# EAGLE design trot_activateur_ES200 (EAGLE 9.3.0)
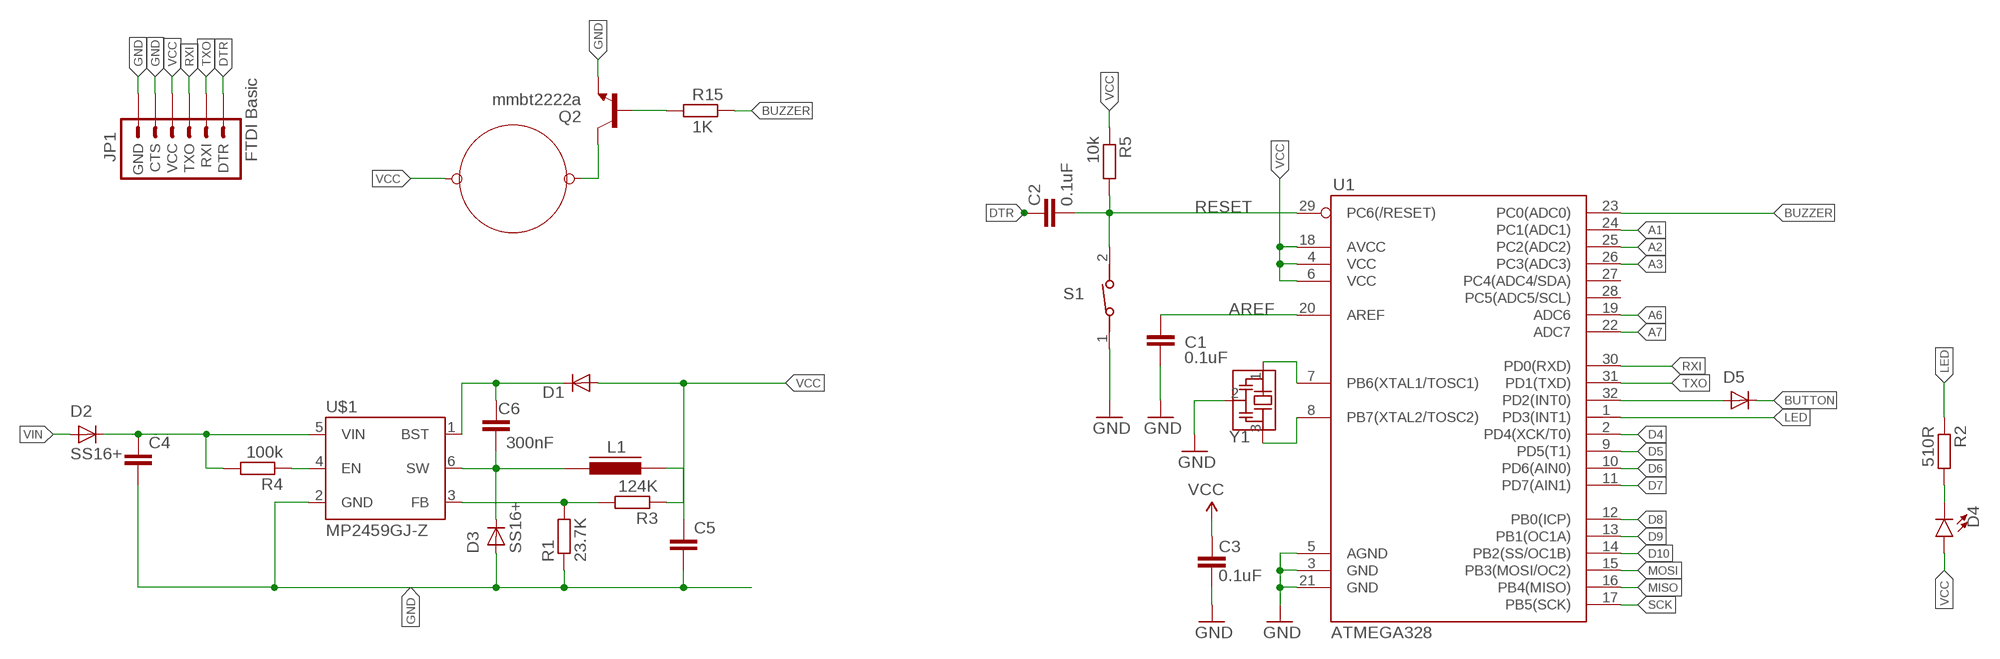
[diagram p0: schematic, sheet 1]

## Parts
C1  0.1uF  C-EUC0603  [C0603]
C2  0.1uF  C-EUC0603  [C0603]
C3  0.1uF  C-EUC0603  [C0603]
C4  4.7uF; X7R; 50V  C-EUC1210  [C1210]
C5  22uF;X7R;10V  C-EUC1210  [C1210]
C6  300nF  C-EUC0603  [C0603]
D1  1N4148W RH  DIODE-SOD123  [SOD123]
D2  SS16+  GF1  [SMA-DO214AC]
D3  SS16+  GF1  [SMA-DO214AC]
D4  LED0603  [LED-0603]
D5  SS16+  GF1  [SMA-DO214AC]
JP1  FTDI Basic  ARDUINO_SERIAL_PROGRAMPTH  [1X06]
L1  VLS5045EX-151M  VLS5045EX  [VLS5045EX]
Q2  mmbt2222a  SPARKFUN_TRANSISTOR_NPNSOT23-3  [SPARKFUN_SOT23-3]
R1  23.7K  R-EU_R0603  [R0603]
R2  510R  R-EU_R0603  [R0603]
R3  124K  R-EU_R0603  [R0603]
R4  100k  R-EU_R0603  [R0603]
R5  10k  R-EU_R0603  [R0603]
R15  1K  R-EU_R0603  [R0603]
S1  434113025826  [434113025826]
U1  ATMEGA328  SPARKFUN_ATMEGA168  [SPARKFUN_TQFP32-08]
U$1  MP2459GJ-Z  [SOT23-6]
U$6  BUZZER-KPX-G1203UB  [BUZZER-KPX-G1203UB]
Y1  CSTNE16M0V530000R0  [OSC_CSTNE16M0V530000R0]

## Nets
A1: U1.24(PC1(ADC1))
A2: U1.25(PC2(ADC2))
A3: U1.26(PC3(ADC3))
A6: U1.19(ADC6)
A7: U1.22(ADC7)
AREF: C1.2 U1.20(AREF)
BUTTON: D5.K(C)
BUZZER: R15.2 U1.23(PC0(ADC0))
D4: U1.2(PD4(XCK/T0))
D5: U1.9(PD5(T1))
D6: U1.10(PD6(AIN0))
D7: U1.11(PD7(AIN1))
D8: U1.12(PB0(ICP))
D9: U1.13(PB1(OC1A))
D10: U1.14(PB2(SS/OC1B))
DTR: C2.2 JP1.1(DTR)
GND [Default]: C1.1 C3.1 C4.2 C5.2 D3.A JP1.5(CTS) JP1.6(GND) Q2.2(E) R1.1 S1.1 U1.3(GND) U1.5(AGND) U1.21(GND) U$1.2(GND) Y1.2(GND)
LED: R2.1 U1.1(PD3(INT1))
MISO: U1.16(PB4(MISO))
MOSI: U1.15(PB3(MOSI/OC2))
N$1: U1.8(PB7(XTAL2/TOSC2)) Y1.3(OUT)
N$2: U1.7(PB6(XTAL1/TOSC1)) Y1.1(IN)
N$3: R4.1 U$1.4(EN)
N$4: C4.1 D2.K(C) R4.2 U$1.5(VIN)
N$5: R1.2 R3.2 U$1.3(FB)
N$6: C6.2 D3.K(C) L1.P$1 U$1.6(SW)
N$7: C6.1 D1.C U$1.1(BST)
N$8: D4.C R2.2
N$10: D5.A U1.32(PD2(INT0))
N$11: Q2.1(B) R15.1
N$12: Q2.3(C) U$6.P$2
RESET: C2.1 R5.2 S1.2 U1.29(PC6(/RESET))
RXI: JP1.3(TXO) U1.30(PD0(RXD))
SCK: U1.17(PB5(SCK))
TXO: JP1.2(RXI) U1.31(PD1(TXD))
VCC: C3.2 C5.1 D1.A D4.A JP1.4(VCC) L1.P$2 R3.1 R5.1 U1.4(VCC) U1.6(VCC) U1.18(AVCC) U$6.P$1
VIN: D2.A
Unconnected: U1.27(PC4(ADC4/SDA)) U1.28(PC5(ADC5/SCL))

## Library data of the parts
C1-C6 = rcl_custom:C-EU: CAPACITOR, European symbol; SPICEPREFIX: C
D1 = diode:DIODE-: DIODE
D2 D3 D5 = diode:GF1: DIODE
D4 = LED:LED: LED (Generic) Standard schematic elements and footprints for 5mm, 3mm, 1206, and 0603 sized LEDs. Generic LEDs with no color specified.
JP1 = SparkFun:ARDUINO_SERIAL_PROGRAM
L1 = inductors_custom:VLS5045EX
Q2 = Adafruit HUZZAH32 ESP32 Feather:SPARKFUN_TRANSISTOR_NPN: Transistor NPN BJT configuration in SOT23 package. MMBT2222 is the common NPN we use. Double check BCE configuration again layout.
R1 R3 = rcl:R-EU_: RESISTOR, European symbol; SPICEPREFIX: R
R2 R4 R5 R15 = rcl_custom:R-EU_: RESISTOR, European symbol; SPICEPREFIX: R
S1 = switch:434113025826: 6.0x3.8 mm SMD J-Bend WS-TASV <http://katalog.we-online.de/media/images/v2/Family_WS-TASV_J-Bend_SMD_6.0x3.jpg> Details see: http://katalog.we-online.de/em/datasheet/4341x30258xx.pdf 2015 (C) Wurth Elektronik
U1 = Atmel_MCU:SPARKFUN_ATMEGA168
U$1 = v-reg-custom:MP2459GJ-Z
U$6 = Buzzer-KPX-G1203UB:BUZZER-KPX-G1203UB
Y1 = crystal_TCXO_RTC:CSTNE16M0V530000R0: 16MHz Ceramic Resonator Built in Capacitor 15pF ±0.15% 40 Ohms -40°C ~ 125°C Surface Mount Check prices <https://pricing.snapeda.com/parts/CSTNE16M0V530000R0/Murata%20Electronics/view-part?ref=eda>; AVAILABILITY: In Stock; DESCRIPTION: 16 MHz Ceramic Resonator Built in Capacitor 15 pF ±0.3% 40 Ohms -40°C ~ 85°C Surface Mount; MF: Murata Electronics; MP: CSTNE16M0V530000R0; PACKAGE: SMD-3 Murata; PRICE: None; PURCHASE-URL: https://pricing.snapeda.com/search/part/CSTNE16M0V530000R0/?ref=eda

## Net classes
0 Pwr: width 0.305 mm, drill 0.3 mm
1 Default: width 0.305 mm, drill 0.3 mm

## Board
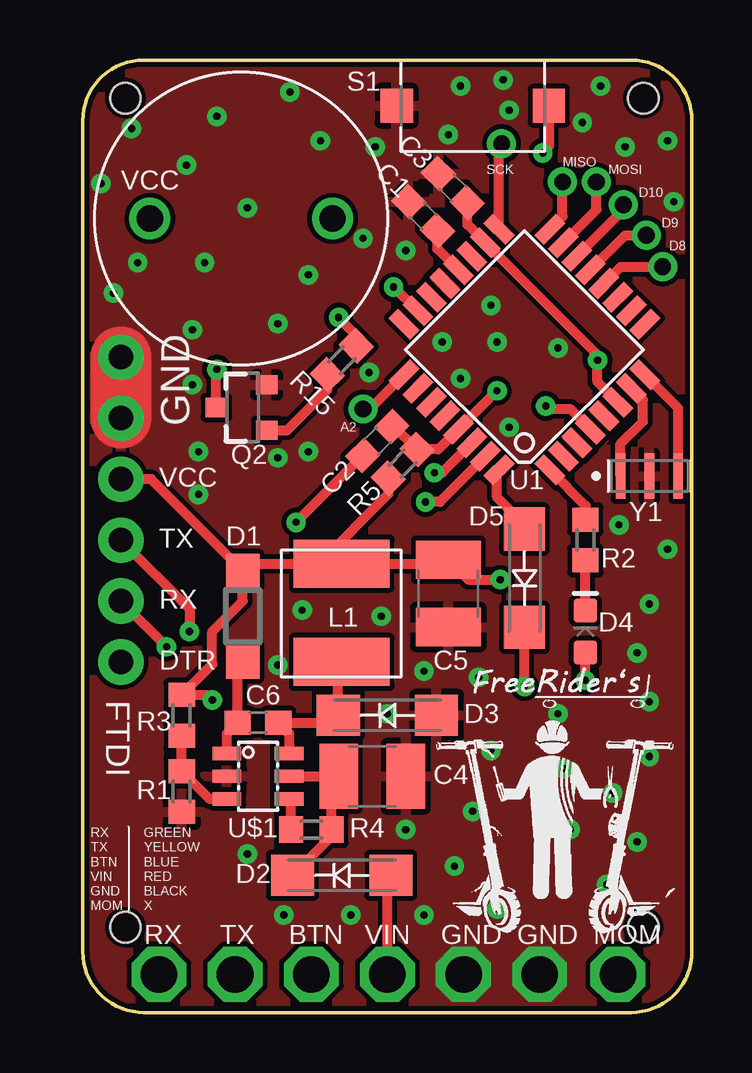
[diagram p1: board, top side]
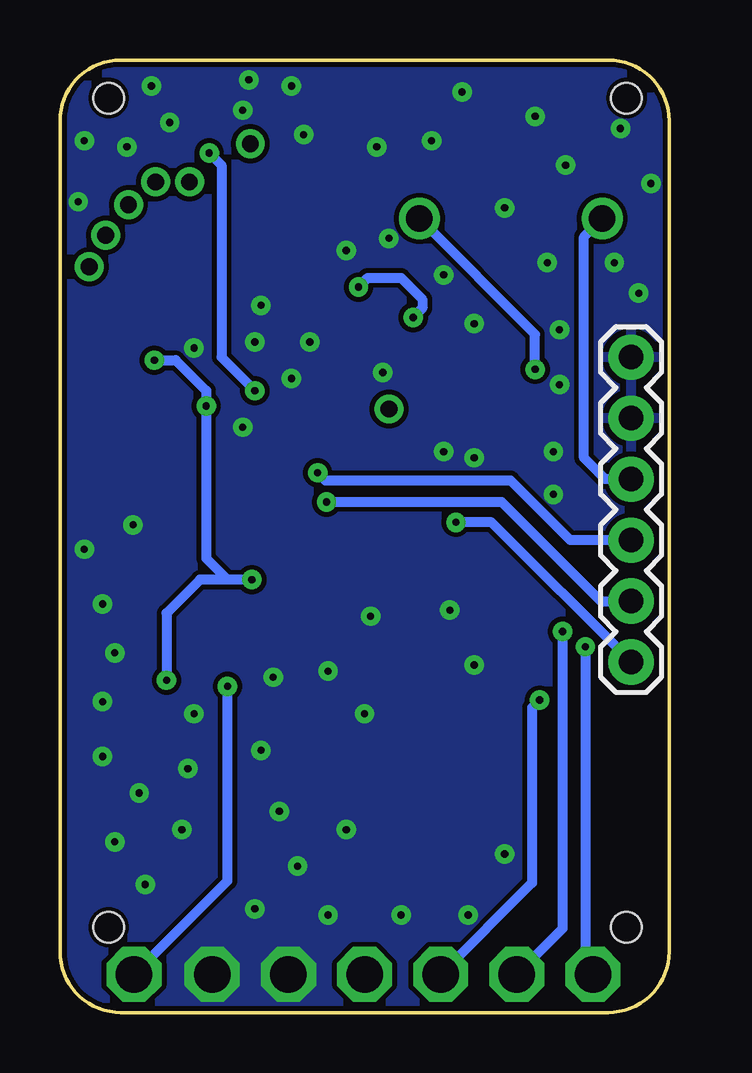
[diagram p2: board, bottom side, seen from below]

Size 25.4 x 39.69 mm. Coordinates in mm from the lower left corner, seen from the top.
Outline: 0,2.54 arc90 2.54,0 22.86,0 arc90 25.4,2.54 25.4,37.15 arc90 22.86,39.69 2.54,39.69 arc90 0,37.15 0,2.54
Copper layers (1*16): Top 0.035mm / dielectric 1.5mm / Bottom 0.035mm
Design rules "SparkFun-2-layer *": minimum track width 7mil, minimum drill 0.3mm, track to track 8mil, track to pad 8mil, pad to pad 8mil, via to via 8mil, smd to smd 8mil, copper to edge 8mil, drill to drill 8mil, minimum pad ring 12mil, minimum via ring 10mil, stop-mask expansion 4mil, vias tented up to drill 20mil, thermal gap 10mil
Holes 1.27 mm at 1.78,3.56 23.37,3.56 23.37,38.1 1.78,38.1

### Footprints (pad centres in the part's own frame; a part is rotated, then mirrored left to right if it is on the bottom)
C0603 = smd 1.1 x 1: 1 -0.85,0; 2 0.85,0
C1210 = smd 1.6 x 2.7: 1 -1.4,0; 2 1.4,0
SOD123 = smd 1.4 x 1.4: A 1.9,0; C -1.9,0
SMA-DO214AC = smd 1.8 x 1.7: A -2.05,0; K 2.05,0
LED-0603 = smd 1 x 1: A -0.877,0; C 0.877,0
1X06 = drill 1.016 pad 1.88: 1 0,0; 2 2.54,0; 3 5.08,0; 4 7.62,0; 5 10.16,0; 6 12.7,0
VLS5045EX = smd 2 x 4: P$1 0,0; P$2 4.1,0
SPARKFUN_SOT23-3 = smd 0.8 x 0.9: 1 -0.95,-1; 2 0.95,-1; 3 0,1.1
R0603 = smd 1 x 1.1: 1 -0.85,0; 2 0.85,0
434113025826 = smd 1.35 x 1.4: 1 -3.175,0; 2 3.175,0
SPARKFUN_TQFP32-08 = smd 1.27 x 0.559: 1 -4.293,2.8; 2 -4.293,2; 3 -4.293,1.2; 4 -4.293,0.4; 5 -4.293,-0.4; 6 -4.293,-1.2; 7 -4.293,-2; 8 -4.293,-2.8; 17 4.293,-2.8; 18 4.293,-2; 19 4.293,-1.2; 20 4.293,-0.4; 21 4.293,0.4; 22 4.293,1.2; 23 4.293,2; 24 4.293,2.8 | smd 0.559 x 1.27: 9 -2.8,-4.293; 10 -2,-4.293; 11 -1.2,-4.293; 12 -0.4,-4.293; 13 0.4,-4.293; 14 1.2,-4.293; 15 2,-4.293; 16 2.8,-4.293; 25 2.8,4.293; 26 2,4.293; 27 1.2,4.293; 28 0.4,4.293; 29 -0.4,4.293; 30 -1.2,4.293; 31 -2,4.293; 32 -2.8,4.293
SOT23-6 = smd 0.55 x 1.2: 1 -0.95,-1.3; 2 0,-1.3; 3 0.95,-1.3; 4 0.95,1.3; 5 0,1.3; 6 -0.95,1.3
BUZZER-KPX-G1203UB = drill 1.1: P$1 3.81,0; P$2 -3.81,0
OSC_CSTNE16M0V530000R0 = smd 0.4 x 1.9: 1 -1.2,0; 2 0,0; 3 1.2,0

### Placement (x,y rotation side)
C1  14.19,33.19 315 top
C2  12.28,23.81 225 top
C3  15.43,34.35 315 top
C4  12.07,9.84 0 top
C5  15.24,17.46 270 top
C6  7.3,12.07 0 top
D1  6.67,16.51 90 top
D2  10.79,5.71 180 top
D3  12.7,12.38 180 top
D4  20.95,15.88 90 top
D5  18.41,18.1 270 top
JP1  1.59,14.61 90 bottom
L1  10.79,14.61 90 top
Q2  6.67,25.21 90 top
R1  4.13,9.21 90 top
R2  20.95,19.68 270 top
R3  4.13,12.38 270 top
R4  9.53,7.62 0 top
R5  13.34,22.86 45 top
R15  10.79,27.18 45 top
S1  16.26,37.78 0 top
U1  18.41,27.62 135 top
U$1  7.3,9.84 270 top
U$6  6.6,33.08 180 top
Y1  23.62,22.35 0 top

### Tracks (layer width: path | path; a pad name or v marks a point on that pad's centre or on a via)
A2  (via drill 0.7)
  Top 0.406: U1.25 11.98,25.15 v11.68,25.15
AREF
  Top 0.406: U1.20 14.79,31.82 C1.2
BUTTON  (via drill 0.3, 1.52)
  Top 0.406: v18.42,13.59 D5.K
  Bottom 0.406: v22.31,1.59 18.42,5.49 v18.42,13.59
BUZZER  (via drill 0.3, 0.3 pad 0.7)
  Top 0.406: U1.23 12.98,30.23 v12.95,30.23 | v10.67,28.96 11.4,28.23 R15.2
  Bottom 0.406: v12.95,30.23 12.57,30.61 11.18,30.61 10.29,29.72 10.29,29.34 v10.67,28.96
D8  (via drill 0.7)
  Top 0.406: U1.12 22.43,31.07 v24.18,31.07
D9  (via drill 0.7)
  Top 0.406: U1.13 22.61,32.39 v23.5,32.39
D10  (via drill 0.7)
  Top 0.406: U1.14 22.54,33.45 v22.54,33.66
DTR  (via drill 0.3)
  Top 0.406: v8.89,20.42 C2.2
  Bottom 0.406: JP1.1 7.4,20.42 v8.89,20.42
GND  (via drill 0.3, 1.52)
  Top 2.54: JP1.6 JP1.5
  other vias: 15.88,1.59 19.05,1.59 20.32,7.62 22.1,9.14 15.49,6.1 23.62,12.95 16.51,13.97 24.38,19.3 23.62,17.02 8.13,28.7 11.68,32.26 5.08,31.24 6.86,33.53 9.91,36.32 17.02,10.92 11.18,4.06 17.27,4.32 13.46,7.62 9.14,16.76 19.81,12.45 23.62,10.67 21.84,5.33 23.11,7.11 14.22,4.06 6.86,6.6 8.38,4.06 8.13,14.48 12.7,12.45 14.22,14.22 9.4,23.37 4.83,23.37 1.27,29.97 2.03,36.83 5.59,37.34 15.75,38.61 17.78,37.59 20.83,37.08 24.64,33.78 17.02,29.46 14.99,27.94 17.27,27.94 9.4,30.73 12.45,16.51 4.32,35.31 8.64,38.35 12.19,36.07 24.38,36.32 22.61,36.07 20.07,10.16 16.26,8.38 4.83,21.59 4.57,26.16 4.57,28.45 2.29,31.24 0.76,34.54 21.59,38.61 17.53,38.86 13.46,31.75 15.75,26.42 17.78,24.38 19.81,27.69 15.24,36.58 11.94,26.67 8.13,23.11 23.11,14.99 22.35,20.32
  pour Top: 0,37.34 0,2.54 arc90 2.54,0 22.86,0 arc90 25.4,2.54 25.4,37.08 arc90 22.86,39.62 2.29,39.62 arc90
  pour Bottom: 0,37.08 0,2.54 arc90 2.54,0 23.11,0 arc90 25.4,2.29 25.4,37.08 arc90 22.86,39.62 2.54,39.62 arc90
LED
  Top 0.406: U1.1 20.96,21.12 R2.1
MISO  (via drill 0.7)
  Top 0.406: U1.16 20,33.17 v20,34.61
MOSI  (via drill 0.7)
  Top 0.406: U1.15 21.41,33.45 v21.41,34.61
N$1
  Top 0.406: Y1.3 24.82,25.18 U1.8
N$2
  Top 0.406: Y1.1 22.42,23.69 23.35,24.62 23.35,25.51 U1.7
N$3
  Top 0.406: R4.1 8.68,8.82 U$1.4
N$4
  Top 0.406: D2.K 10.38,7.35 R4.2 10.38,9.55 C4.1 U$1.5
N$5
  Top 0.406: U$1.3 5.29,8.89 R1.2 R3.2
N$6
  Top 0.406: L1.P$1 10.65,14.46 D3.K 10.33,12.07 C6.2 8.6,11.62 U$1.6
N$7
  Top 0.406: U$1.1 6,11.62 C6.1 6.45,14.4 D1.C
N$8
  Top 0.406: D4.C R2.2
N$10
  Top 0.406: D5.A 18.42,20.32 17.27,21.46 17.27,22.52 U1.32
N$11
  Top 0.406: Q2.1 8.51,24.26 10.19,25.94 R15.1
N$12  (via drill 0.3 pad 0.7)
  Top 0.406: Q2.3 5.57,26.78 v5.59,26.8
  Bottom 0.406: U$6.P$2 5.59,28.26 v5.59,26.8
RESET  (via drill 0.3)
  Top 0.406: S1.2 19.43,36.07 v19.18,35.81 | v17.27,25.91 U1.29 14.82,23.46 R5.2 12.98,24.41 C2.1
  Bottom 0.406: v19.18,35.81 18.67,35.31 18.67,27.31 v17.27,25.91
RXI  (via drill 0.3, 1.52)
  Top 0.406: v14.66,22.49 14.98,22.49 U1.30 | JP1.3 4.45,16.83 v4.45,15.88
  Bottom 0.406: JP1.3 4.13,19.69 6.61,22.17 14.34,22.17 v14.66,22.49 | v4.45,15.88 4.45,3.49 v6.35,1.59
SCK  (via drill 0.7)
  Top 0.406: U1.17 17.36,36.09 v17.46,36.2
TXO  (via drill 0.3, 1.52)
  Top 0.406: U1.31 14.89,21.27 v14.29,21.27 | JP1.2 v3.49,15.24
  Bottom 0.406: v14.29,21.27 6.99,21.27 2.86,17.15 JP1.2 | v3.49,15.24 3.49,1.91 v3.18,1.59
VCC  (via drill 0.3, 1.52)
  Top 0.406: C3.2 16.03,32.83 U1.18 21.46,27.4 v21.46,27.18 21.46,26.27 U1.6 | D1.A 6.96,18.71 9.84,18.71 | 9.84,18.71 L1.P$2 15.08,18.71 C5.1 16.07,18.03 v17.4,18.03 | D1.A 2.85,22.23 JP1.4 | v20.96,13.84 D4.A | v19.3,25.27 19.43,25.15 20.33,25.15 U1.4 | D1.A 6.67,17.15 5.4,15.88 5.4,14.5 R3.1 5.18,13.23 v5.4,13.02 | R5.1 12.73,21.6 9.84,18.71
  Bottom 0.406: JP1.4 2.67,22.23 3.56,23.11 3.56,32.32 U$6.P$1 | v17.4,18.03 18.42,18.03 | 18.42,18.03 19.56,18.03 20.96,16.64 v20.96,13.84 | v21.46,27.18 20.57,27.18 19.3,25.91 v19.3,25.27 19.3,18.92 18.42,18.03 | v5.4,13.02 5.72,12.7 5.72,5.4 v9.53,1.59
VIN  (via drill 1.52)
  Top 0.406: v12.7,1.59 12.7,5.57 D2.A

### Text on the board
tNames: SCK | MISO | MOSI | VCC | D10 | D9 | D8 | GND | A2 | VCC | TX | RX | DTR | FTDI | RX / TX / BTN / VIN / GND / MOM | GREEN / YELLOW / BLUE / RED / BLACK / X | RX | TX | BTN | VIN | GND | GND | MOM
tValues: Valid combinations: | 168V / 3.3V Reg / 8MHz | 168 / 5V Reg / 16MHz | 168 / 5V Reg / 20MHz | Mark back accordingly | Arduino Pro Mini